# EAGLE design MainBoard 1.9.0 (EAGLE 9.6.2)
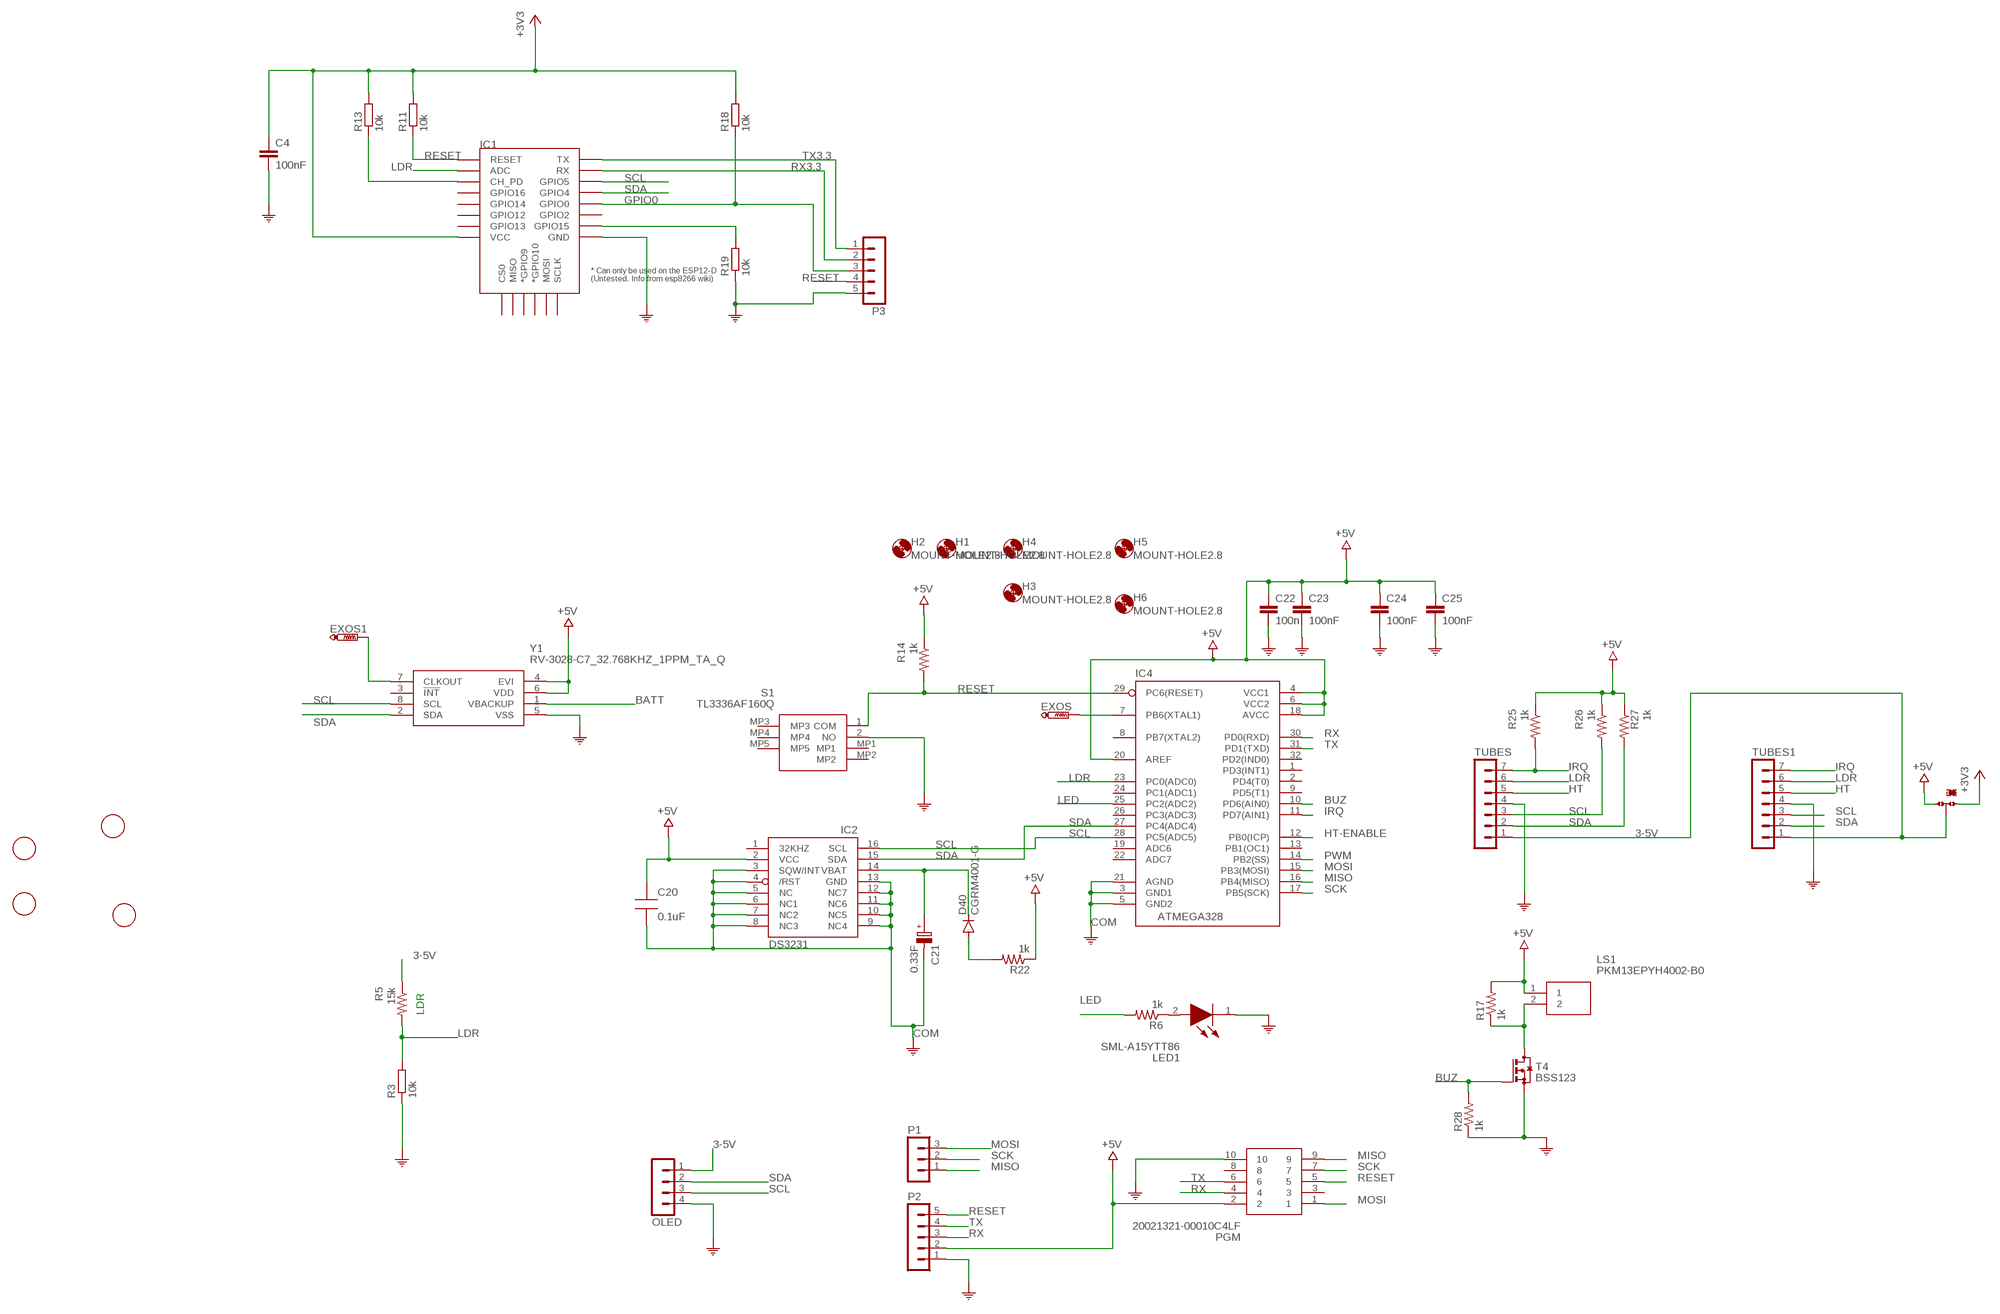
[diagram p0: schematic, sheet 1, part 1 of 2]
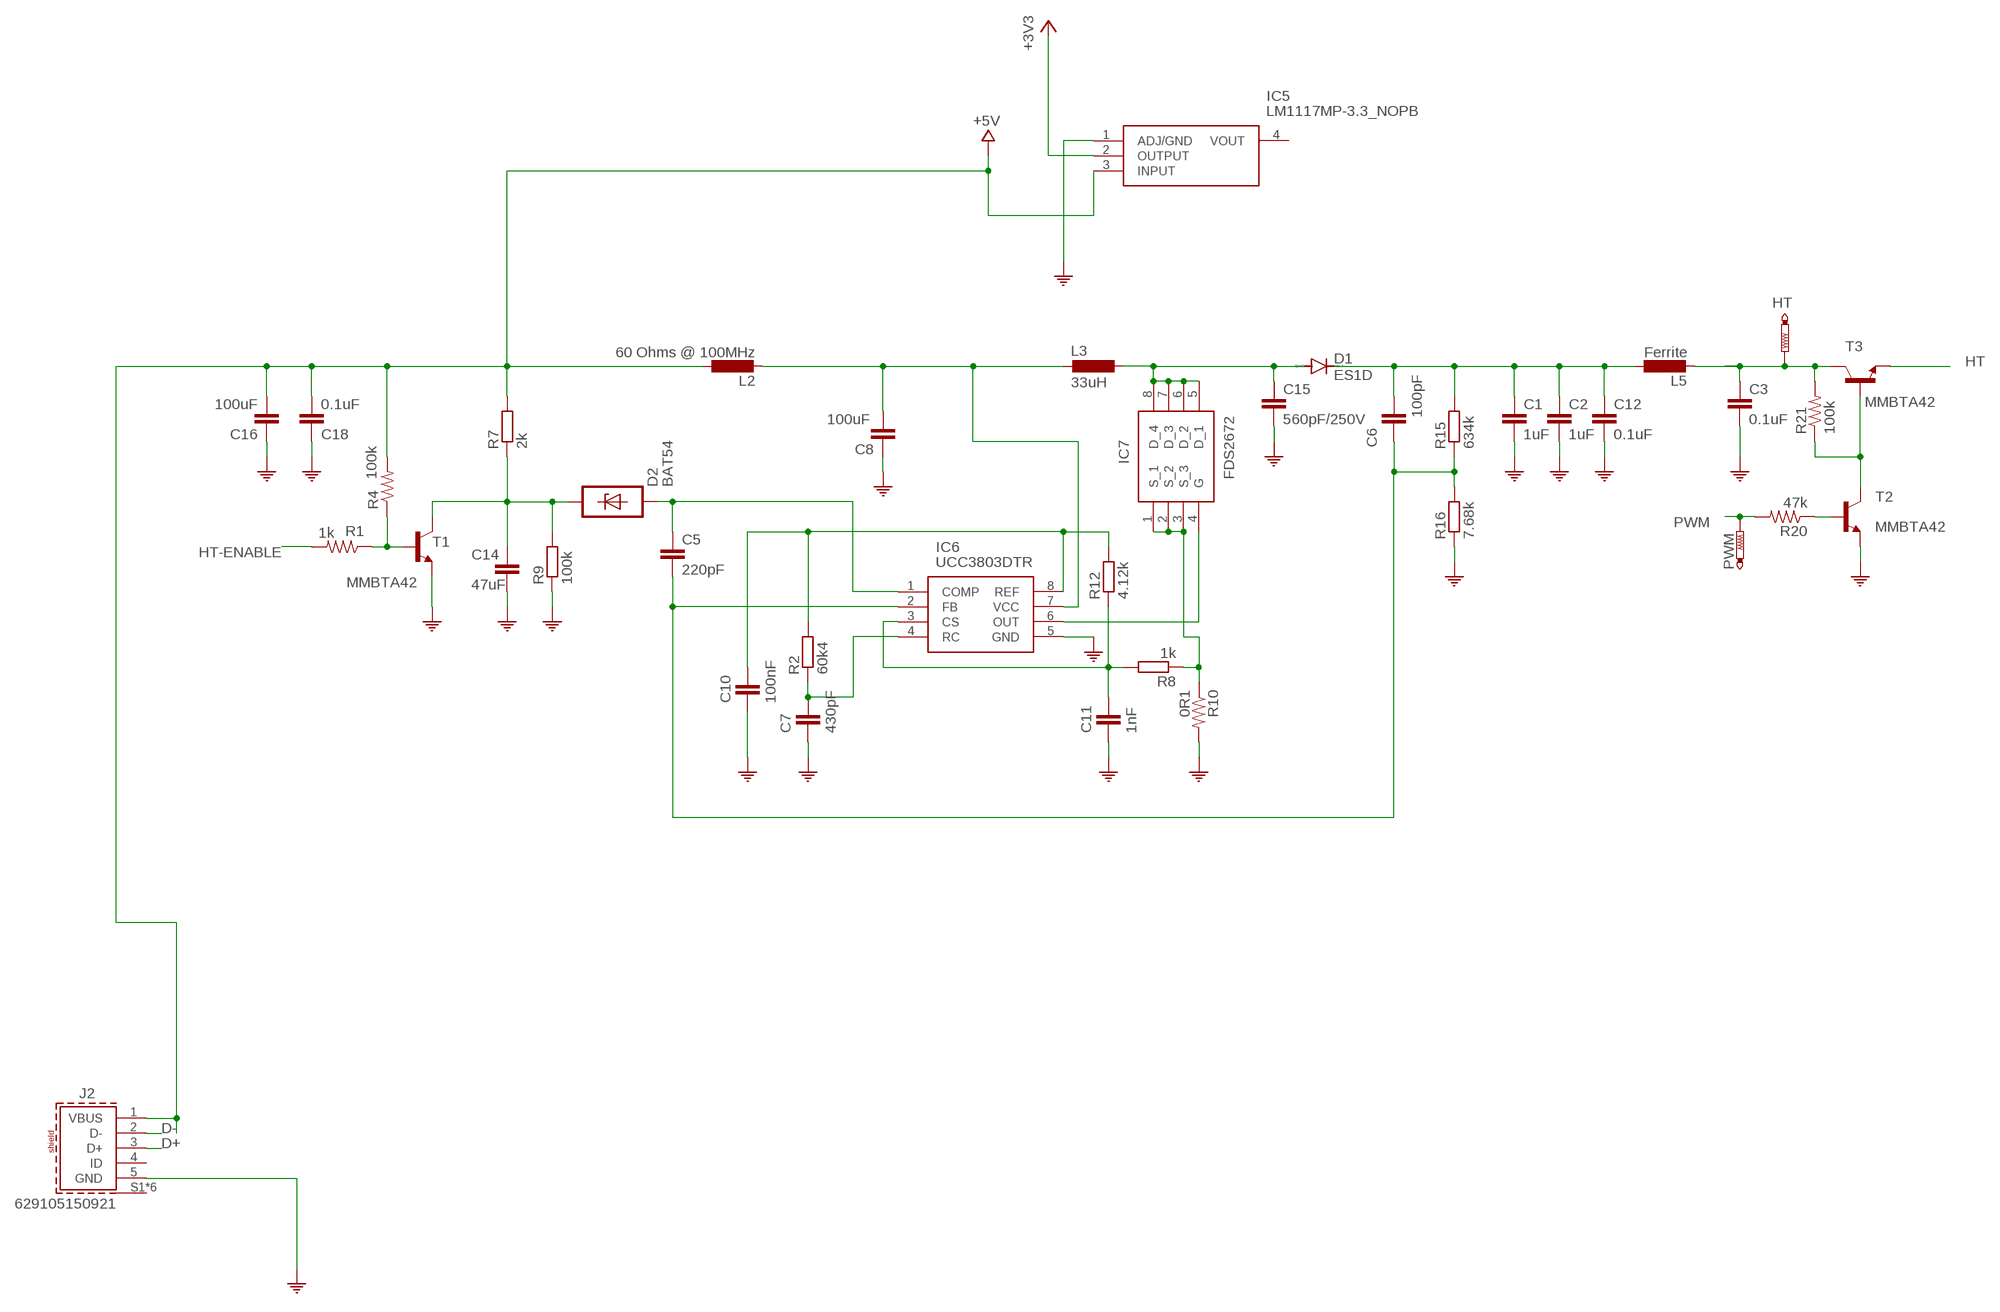
[diagram p1: schematic, sheet 1, part 2 of 2]

## Parts
C1  1uF  C-EUC1812K  [C1812K]
C2  1uF  C-EUC1812K  [C1812K]
C3  0.1uF  C-EUC1808  [C1808]
C4  100nF  C-EUC1812K  [C1812K]
C5  220pF  C-EUC0402  [C0402]
C6  100pF  C-EUC0805  [C0805]
C7  430pF  C-EUC0805  [C0805]
C8  100uF  C-EUC1210  [C1210]
C10  100nF  C-EUC0805  [C0805]
C11  1nF  C-EUC0805  [C0805]
C12  0.1uF  C-EUC1808  [C1808]
C14  47uF  C-EUC1210  [C1210]
C15  560pF/250V  C-EUC0603  [C0603]
C16  100uF  C-EUC1210  [C1210]
C18  0.1uF  C-EUC0402  [C0402]
C20  0.1uF  CAP0805-NP  [CAP0805-NP]
C21  0.33F  AHG-35/100-RADIAL  [ELNA21.5X8.0]
C22  100n  C-EUC0805  [C0805]
C23  100nF  C-EUC0805  [C0805]
C24  100nF  C-EUC0805  [C0805]
C25  100nF  C-EUC0805  [C0805]
D1  ES1D  ES2D  [SMB]
D2  BAT54  SP4020-01FTG  [SOD323]
D40  CGRM4001-G  [SOD-123_MINI-SMA]
EXOS  PTR1TP09R  [TP09R]
EXOS1  PTR1TP09R  [TP09R]
H1  MOUNT-HOLE2.8  [2,8]
H2  MOUNT-HOLE2.8  [2,8]
H3  MOUNT-HOLE2.8  [2,8]
H4  MOUNT-HOLE2.8  [2,8]
H5  MOUNT-HOLE2.8  [2,8]
H6  MOUNT-HOLE2.8  [2,8]
HT  PTR1TP09R  [TP09R]
IC1  ESP12ESMD  [ESP12E-SMD]
IC2  DS3231/SO  [SO16W]
IC4  ATMEGA328  ATMEGA168-20AU  [QFP032]
IC5  LM1117MP-3.3_NOPB  [SOT230P700X180-4N]
IC6  UCC3803DTR  [SOIC127P600X175-8N]
IC7  FDS2672  [SOIC127P600X175-8N]
J2  629105150921  [629105150921]
L2  60 Ohms @ 100MHz  L-EUL2012C  [L2012C]
L3  33uH  MSS7341  [MSS7341]
L5  Ferrite  L-EUL2012C  [L2012C]
LED1  SML-A15YTT86  [SMLA15YTT86]
LS1  PKM13EPYH4002-B0  [PKM13EPYH4002-B0]
OL2  0R-JUMPA  [A0R-JMP]
OLED  MA04-1  [MA04-1]
P1  MA03-1  [MA03-1]
P2  MA05-1  [MA05-1]
P3  MA05-1  [MA05-1]
PGM  20021321-00010C4LF  [2002132100010C4LF]
PWM  PTR1TP09R  [TP09R]
R1  1k  R-US_R0805  [R0805]
R2  60k4  R-EU_R0805  [R0805]
R3  10k  R-EU_M2012  [M2012]
R4  100k  R-US_R0805  [R0805]
R5  15k  R-US_0204/2V  [0204V]
R6  1k  R-US_M2012  [M2012]
R7  2k  R-EU_R0805  [R0805]
R8  1k  R-EU_R0805  [R0805]
R9  100k  R-EU_R0805  [R0805]
R10  0R1  R-US_R2010  [R2010]
R11  10k  R-EU_M0805  [M0805]
R12  4.12k  R-EU_R0805  [R0805]
R13  10k  R-EU_M0805  [M0805]
R14  1k  R-US_M2012  [M2012]
R15  634k  R-EU_R0805  [R0805]
R16  7.68k  R-EU_R0805  [R0805]
R17  1k  R-US_M2012  [M2012]
R18  10k  R-EU_M0805  [M0805]
R19  10k  R-EU_M0805  [M0805]
R20  47k  R-US_R0805  [R0805]
R21  100k  R-US_R0805  [R0805]
R22  1k  R-US_M2012  [M2012]
R25  1k  R-US_M2012  [M2012]
R26  1k  R-US_M2012  [M2012]
R27  1k  R-US_M2012  [M2012]
R28  1k  R-US_M2012  [M2012]
S1  TL3336AF160Q  [TL3336AF160Q]
T1  MMBTA42  BC846  [SOT23]
T2  MMBTA42  BC846  [SOT23]
T3  MMBTA42  BC846  [SOT23]
T4  BSS123  [SOT23]
TUBES  MA07-1  [MA07-1]
TUBES1  MA07-1  [MA07-1]
U$4  FIDUCIAL  [FIDUCIAL_1MM]
U$5  FIDUCIAL  [FIDUCIAL_1MM]
U$20  FIDUCIAL  [FIDUCIAL_1MM]
U$36  FIDUCIAL  [FIDUCIAL_1MM]
Y1  RV-3028-C7_32.768KHZ_1PPM_TA_Q  [RV3028C732768KHZ1PPMTAQC]

## Nets
3-5V [pwr]: OL2.2 OLED.1 R5.1 TUBES1.1 TUBES.1
+3V3: C4.1 IC1.VCC IC5.2(OUTPUT) OL2.1 R11.2 R13.2 R18.2
+5V [pwr]: C16.2 C18.1 C20.1 C22.1 C23.1 C24.1 C25.1 IC2.2(VCC) IC4.4(VCC1) IC4.6(VCC2) IC4.18(AVCC) IC4.20(AREF) IC5.3(INPUT) J2.1(VBUS) L2.1 LS1.1 OL2.3 P2.2 PGM.2 R4.2 R7.2 R14.1 R17.2 R22.1 R25.1 R26.1 R27.1 Y1.4(EVI) Y1.6(VDD)
BATT: C21.+ D40.C IC2.14(VBAT) Y1.1(VBACKUP)
BUZ: IC4.10(PD6(AIN0)) R28.2 T4.1(G)
COM: C1.2 C2.2 C3.2 C4.2 C7.2 C8.1 C10.2 C11.2 C12.2 C14.2 C15.2 C16.1 C18.2 C20.2 C21.- C22.2 C23.2 C24.2 C25.2 IC1.GND IC2.3(SQW/INT) IC2.4(/RST) IC2.5(NC) IC2.6(NC1) IC2.7(NC2) IC2.8(NC3) IC2.9(NC4) IC2.10(NC5) IC2.11(NC6) IC2.12(NC7) IC2.13(GND) IC4.3(GND1) IC4.5(GND2) IC4.21(AGND) IC5.1(ADJ/GND) IC6.5(GND) J2.5(GND) LED1.1(K) OLED.4 P2.1 P3.5 PGM.10 R3.1 R9.1 R10.2 R16.1 R19.1 R28.1 S1.2(NO) T1.2(E) T2.2(E) T4.2(S) TUBES1.4 TUBES.4 Y1.5(VSS)
CS: C11.1 IC6.3(CS) R8.2 R12.1
D+: J2.3(D+)
D-: J2.2(D-)
FB: C5.2 C6.2 IC6.2(FB) R15.1 R16.2
GPIO0: IC1.GPIO0 P3.3 R18.1
HT: T3.2(E) TUBES1.5 TUBES.5
HT-ENABLE: IC4.12(PB0(ICP)) R1.2
IRQ: IC4.11(PD7(AIN1)) R25.2 TUBES1.7 TUBES.7
LDR: IC1.ADC IC4.23(PC0(ADC0)) R3.2 R5.2 TUBES1.6 TUBES.6
LED: IC4.25(PC2(ADC2)) R6.2
MISO: IC4.16(PB4(MISO)) P1.1 PGM.9
MOSI: IC4.15(PB3(MOSI)) P1.3 PGM.1
N$1: LED1.2(A) R6.1
N$2: IC1.CH_PD R13.1
N$3: LS1.2 R17.1 T4.3(D)
N$5: EXOS.TP IC4.7(PB6(XTAL1))
N$6: C1.1 C2.1 C6.1 C12.1 D1.C L5.1 R15.2
N$7: R21.1 T2.3(C) T3.1(B)
N$8: R1.1 R4.1 T1.1(B)
N$9: C14.1 D2.C R7.1 R9.2 T1.3(C)
N$10: C5.1 D2.A IC6.1(COMP)
N$11: IC1.GPIO15 R19.2
N$12: IC7.1(S_1) IC7.2(S_2) IC7.3(S_3) R8.1 R10.1
N$13: EXOS1.TP Y1.7(CLKOUT)
N$14: C8.2 IC6.7(VCC) L2.2 L3.1
N$18: C15.1 D1.A IC7.5(D_1) IC7.6(D_2) IC7.7(D_3) IC7.8(D_4) L3.2
N$19: R20.1 T2.1(B)
N$23: D40.A R22.2
OUT: IC6.6(OUT) IC7.4(G)
PWM: IC4.14(PB2(SS)) PWM.TP R20.2
RAW_HT: C3.1 HT.TP L5.2 R21.2 T3.3(C)
RC: C7.1 IC6.4(RC) R2.1
REF: C10.1 IC6.8(REF) R2.2 R12.2
RESET: IC1.RESET IC4.29(PC6(RESET)) P2.5 P3.4 PGM.5 R11.1 R14.2 S1.1(COM)
RX: IC4.30(PD0(RXD)) P2.3 PGM.4
RX3.3: IC1.RXD0(RX) P3.2
SCK: IC4.17(PB5(SCK)) P1.2 PGM.7
SCL: IC1.GPIO5 IC2.16(SCL) IC4.28(PC5(ADC5)) OLED.3 R26.2 TUBES1.3 TUBES.3 Y1.8(SCL)
SDA: IC1.GPIO4 IC2.15(SDA) IC4.27(PC4(ADC4)) OLED.2 R27.2 TUBES1.2 TUBES.2 Y1.2(SDA)
TX: IC4.31(PD1(TXD)) P2.4 PGM.6
TX3.3: IC1.TXD0(TX) P3.1
Unconnected: IC1.CS0 IC1.GPIO2 IC1.GPIO9(*GPIO9) IC1.GPIO10(*GPIO10) IC1.GPIO12 IC1.GPIO13 IC1.GPIO14 IC1.GPIO16 IC1.MISO IC1.MOSI IC1.SCLK IC2.1(32KHZ) IC4.1(PD3(INT1)) IC4.2(PD4(T0)) IC4.8(PB7(XTAL2)) IC4.9(PD5(T1)) IC4.13(PB1(OC1)) IC4.19(ADC6) IC4.22(ADC7) IC4.24(PC1(ADC1)) IC4.26(PC3(ADC3)) IC4.32(PD2(IND0)) IC5.4(VOUT) J2.4(ID) J2.S1(SHIELD) J2.S2(SHIELD) J2.S3(SHIELD) J2.S4(SHIELD) J2.S5(SHIELD) J2.S6(SHIELD) PGM.3 PGM.8 S1.MP1 S1.MP2 S1.MP3 S1.MP4 S1.MP5 Y1.3(!INT)

## Notes on the sheet
- LDR

## Library data of the parts
C1 C2 = rcl:C-EU: CAPACITOR, European symbol; MOUSER: 810-CGA8P3X7T2E105MA; PU: 1.07; SPICEPREFIX: C; TDK: C4532X7T2E105M250KE
C3 C12 = rcl:C-EU: CAPACITOR, European symbol; MOUSER: 581-1808PC104KAT1A; PU: 0.88; SPICEPREFIX: C
C4 = resistor:C-EU: CAPACITOR, European symbol
C5 = rcl:C-EU: CAPACITOR, European symbol; MOUSER: 963-LMK042B7221KC-W; SPICEPREFIX: C
C6 = rcl:C-EU: CAPACITOR, European symbol; MOUSER: 81-GCM21A5C2E101JX1D; PU: 0.319; SPICEPREFIX: C
C7 = rcl:C-EU: CAPACITOR, European symbol; MOUSER: 581-08055A431JAT4A; PU: 0.23; SPICEPREFIX: C
C8 C16 = rcl:C-EU: CAPACITOR, European symbol; MOUSER: 963-EMK325ABJ107MM-P; SPICEPREFIX: C; TAIYO_YUDEN: EMK325ABJ107MM-P
C10 = rcl:C-EU: CAPACITOR, European symbol; MOUSER: 963-EMF212B7104KGHT; PU: 0.23; SPICEPREFIX: C
C11 = rcl:C-EU: CAPACITOR, European symbol; MOUSER: 710-885382207004; PU: 0.122; SPICEPREFIX: C
C14 = rcl:C-EU: CAPACITOR, European symbol; MOUSER: EMK316BBJ476ML-T; SPICEPREFIX: C
C15 = rcl:C-EU: CAPACITOR, European symbol; MOUSER: 80-C0603C561JAG; PU: 0.038; SPICEPREFIX: C
C18 = rcl:C-EU: CAPACITOR, European symbol; MOUSER: 963-LMF105B7104KVHF; PU: 0.676; SPICEPREFIX: C
C20 = MySMD:CAP0805-NP
C21 = Elkos:AHG-35/100-RADIAL: AUDYN® - AHG Gepolt, radial High Grade AHG Gepolter Elekrolytkondensator für Audio-Netzteile, oder Verstärker im Home- und Car-Bereich. Technische Daten Anschlußdrähte: Kupfer, verzinnt AL: ? mm d2ø : ? mm Kapazitätsbereich: von 10 µF bis 2200 µF Nennspannungen: 25 V, 35 V, 50 V, 100 V C-Toleranz: 20 % ( bei 20° C ) Verlustfaktor: tan δ < 0,100 @ 1 kHz Temperaturbereich: - 40° C bis 85° C Verzerrung: sehr gering bei 10 kHz, 010 A - 120 dB oder niedriger gepolt AHG AUDYN® - AHG gepolt Bezeichnung C U DxH Rm Bestell.-Nr. U / Volt D x L/mm mm AHG/10.0/100V 10µF 100V 10x15 5,0 1341690 AHG/22.0/50V 22µF 50V 10x13 5,0 1341691 AHG/47.0/50V 47µF 50V 10x16 5,0 1341692 AHG/100.0/50V 100µF 50V 13x21 5,0 1341693 AHG/220.0/50V 220µF 50V 16x25 7,5 1341694 AHG/470.0/50V 470µF 50V 16x37 7,5 1341695 AHG/1000/35V 1000µF 35V 18x37 7,5 1341696 AHG/2200/35V 2200µF 35V 22x38 10,0 1341697 Alle Abmessungen in mm; MOUSER: 555-DBN-5R5D334T; PU: 2.46
C22-C25 = rcl:C-EU: CAPACITOR, European symbol; SPICEPREFIX: C
D1 = diode:ES2D: DIODE super fast rectifier, 2 A; MOUSER: 512-ES1D
D2 = sp4020_11:SP4020-01FTG: SP4020 Series 2.5pF, 30A Discrete TVS Diode Source: http://www.littelfuse.com/~/media/electronics/datasheets/tvs_diode_arrays/littelfuse_tvs_diode_array_sp4020_datasheet.pdf.pdf; MF: Littelfuse; MOUSER: 621-BAT54WS-F; MPN: SP4020-01FTG; OC_FARNELL: unknown; OC_NEWARK: 05X0400
D40 = diode:CGRM400*-G: Molded plasitc,JEDEC SOD-123/Mini SMA Source: Comchip CGRM4001-G.pdf; MOUSER: 771-PMEG2010EA135; PU: 0.22
EXOS EXOS1 HT PWM = testpad:PTR1: TEST PIN
H1-H6 = holes:MOUNT-HOLE: MOUNTING HOLE with drill center marker
IC1 = esp8266modules:ESP12E: ESP12E Module
IC2 = DS3231:DS3231; AVAILABILITY: Unavailable; MF: Maxim Integrated; MOUSER: 700-DS3231SN#; MP: DS3231; PACKAGE: SOIC-16 Maxim Integrated; PRICE: None; PU: 9.50
IC4 = MySMD:ATMEGA168-20AU; PU: 1.40
IC5 = SamacSys_Parts:LM1117MP-3.3_NOPB: Space saving 800-mA low-dropout linear regulator with internal current limit Source: Datasheet <http://www.ti.com/general/docs/suppproductinfo.tsp?distId=10&gotoUrl=http://www.ti.com/lit/gpn/lm1117>; DESCRIPTION: Space saving 800-mA low-dropout linear regulator with internal current limit; HEIGHT: 1.8mm; MANUFACTURER_NAME: Texas Instruments; MANUFACTURER_PART_NUMBER: LM1117MP-3.3/NOPB; MOUSER_PART_NUMBER: 926-LM1117MP-3.3NOPB; MOUSER_PRICE-STOCK: https://www.mouser.co.uk/ProductDetail/Texas-Instruments/LM1117MP-33-NOPB?qs=X1J7HmVL2ZFn4x9DZ4T2hA%3D%3D
IC6 = UCC3803DTR:UCC3803DTR: Switching Controllers Low-Power BiCMOS Current-Mode PWM Source: Datasheet <http://www.ti.com/lit/ds/symlink/ucc3803.pdf>; DESCRIPTION: Switching Controllers Low-Power BiCMOS Current-Mode PWM; HEIGHT: 1.75mm; MANUFACTURER_NAME: Texas Instruments; MANUFACTURER_PART_NUMBER: UCC3803DTR; MOUSER: 595-UCC3803D; MOUSER_PART_NUMBER: 595-UCC3803DTR; MOUSER_PRICE-STOCK: https://www.mouser.com/Search/Refine.aspx?Keyword=595-UCC3803DTR; PU: 3.05
IC7 = FDS2672:FDS2672: FDS2672, N-channel MOSFET Transistor 3.9 A 200 V, 8-Pin SOIC Source: Datasheet <http://docs-emea.rs-online.com/webdocs/0d23/0900766b80d23481.pdf>; DESCRIPTION: FDS2672, N-channel MOSFET Transistor 3.9 A 200 V, 8-Pin SOIC; HEIGHT: 1.75mm; MANUFACTURER_NAME: Fairchild Semiconductor; MANUFACTURER_PART_NUMBER: FDS2672; MOUSER: 512-FDS2672; MOUSER_PART_NUMBER: 512-FDS2672; MOUSER_PRICE-STOCK: https://www.mouser.com/Search/Refine.aspx?Keyword=512-FDS2672; PU: 1.54; RS_PART_NUMBER: 6710481P; RS_PRICE-STOCK: http://uk.rs-online.com/web/p/products/6710481P
J2 = Wurth_Connectors_WR-USB:629105150921: WR-COM Micro USB 2.0 Type AB Horizontal Kind Properties Durability:10 000 Mating cycles Connector Type:Micro USB Gender:Receptacle Type:Horizontal General Information Operating Temperature:-40up to +85 °C Electrical Properties Working Voltage:30V (AC) Withstanding Voltage:100V (AC) Contact Resistance:30 mΩ Material Properties Insulator Material:LCP Insulator Flammability Rating:UL94 V-0 Color:Black Contact Material:Copper Alloy Contact Plating: Gold Contact Type:Stamped Shielding Material:Stainless Steel Shielding Plating:Matte Tin <https://www.we-online.com/catalog/media/o33046v209%20Family_WR-COM_Micro_USB_629105150921.jpg> Details see: https://www.we-online.com/catalog/en/COM_MICRO_2_0_TYPE_AB_HORIZONTAL/ Updated by Ella Wu 2021-03-09 2021 (C) Würth Elektronik; APPLICATION: Micro USB 2.0; DATASHEET-URL: https://www.we-online.com/catalog/datasheet/629105150921.pdf; GERDER: Receptacle; INTERFACE-TYPE: Type AB; IR1: 1.8A; MOUNT: SMT; MOUSER: 710-629105150921; PACKAGING: Tape and Reel; PART-NUMBER: 629105150921; PINS: 5; PU: 1.90; TYPE: Horizontal; WORKING-VOLTAGE: 30V(AC)
L2 L5 = rcl:L-EU: INDUCTOR, European symbol; MOUSER: 963-BKP2125HS600-T; SPICEPREFIX: L
L3 = STEAM-inductor-coilcraft:MSS7341: Shielded Power Inductors Package 6.6 × 6.6 mm x 4.1 mm high Source: http://www.farnell.com/datasheets/1681958.pdf; MOUSER: 710-784770330; PU: 2.55
LED1 = SamacSys_Parts:SML-A15YTT86: Yellow 590nm LED Indication - Discrete 2.1V 2-SMD, No Lead Source: Datasheet <https://fscdn.rohm.com/en/products/databook/datasheet/opto/led/chip_mono/sml-a15x-e.pdf>; DESCRIPTION: Yellow 590nm LED Indication - Discrete 2.1V 2-SMD, No Lead; HEIGHT: 0.65mm; MANUFACTURER_NAME: ROHM Semiconductor; MANUFACTURER_PART_NUMBER: SML-A15YTT86; MOUSER: 755-SML-A15YTT86; PU: 0.25
LS1 = SamacSys_Parts:PKM13EPYH4002-B0: Transducer piezo PCB 30Vpp 70dB 12.6mm Murata Buzzer Source: Datasheet <http://www.murata.com/~/media/webrenewal/support/library/catalog/products/sound/p37e.ashx>; DESCRIPTION: Transducer piezo PCB 30Vpp 70dB 12.6mm Murata Buzzer; HEIGHT: mm; MANUFACTURER_NAME: Murata Electronics; MANUFACTURER_PART_NUMBER: PKM13EPYH4002-B0; MOUSER_PART_NUMBER: 81-PKM13EPYH4002-B0; MOUSER_PRICE-STOCK: https://www.mouser.co.uk/ProductDetail/Murata-Electronics/PKM13EPYH4002-B0?qs=flZjIlU0hx09jX8FupUNIw%3D%3D
OL2 = jump-0r-smd:0R-JUMP: SMD 0R 0805 Jumper
OLED = con-lstb:MA04-1: PIN HEADER; OC_FARNELL: unknown; OC_NEWARK: unknown
P1 = con-lstb:MA03-1: PIN HEADER; OC_FARNELL: unknown; OC_NEWARK: unknown
P2 P3 = con-lstb:MA05-1: PIN HEADER; OC_FARNELL: unknown; OC_NEWARK: unknown
PGM = SamacSys_Parts:20021321-00010C4LF: Headers & Wire Housings 1.27x1.27mm BTB, Hdr Recept, SMT, 10 Pos Source: Datasheet <https://componentsearchengine.com/Datasheets/1/20021321-00010C4LF.pdf>; DESCRIPTION: Headers & Wire Housings 1.27x1.27mm BTB, Hdr Recept, SMT, 10 Pos; HEIGHT: 4.75mm; MANUFACTURER_NAME: Amphenol; MANUFACTURER_PART_NUMBER: 20021321-00010C4LF; MOUSER_PART_NUMBER: 649-200211210010D8LF; MOUSER_PRICE-STOCK: https://www.mouser.com/Search/Refine.aspx?Keyword=649-202132100010C4LF
R1 R6 R14 R17 R22 R25-R28 = adafruit:R-US_: RESISTOR, American symbol; MOUSER: 660-RK73H2ATTDD1001F
R2 = rcl:R-EU_: RESISTOR, European symbol; MOUSER: 603-RT0805FRE0760K4L; PU: 0.11; SPICEPREFIX: R
R3 = rcl:R-EU_: RESISTOR, European symbol; MOUSER: 660-RK73H2ATTDD1002F; SPICEPREFIX: R
R4 R5 R20 R21 = adafruit:R-US_: RESISTOR, American symbol
R7 = rcl:R-EU_: RESISTOR, European symbol; MOUSER: 754-RR1220P-202D; SPICEPREFIX: R; SUSUMU: RR1220P-202-D
R8 = rcl:R-EU_: RESISTOR, European symbol; MOUSER: 660-RK73H2ATTDD1001F; SPICEPREFIX: R
R9 = rcl:R-EU_: RESISTOR, European symbol; SPICEPREFIX: R
R10 = adafruit:R-US_: RESISTOR, American symbol; MOUSER: 603-PE2010FKE070R1L; PU: 0.7
R11 R13 R18 R19 = resistor:R-EU_: RESISTOR, European symbol; MOUSER: 660-RK73H2ATTDD1002F
R12 = rcl:R-EU_: RESISTOR, European symbol; KOASPEER: RN732ATTD4121F100; MOUSER: 660-RN732ATD4121F100; SPICEPREFIX: R
R15 = rcl:R-EU_: RESISTOR, European symbol; MOUSER: 71-CRCW0603-634K-E3; SPICEPREFIX: R; VISHAY: CRCW0603634KFKEA
R16 = rcl:R-EU_: RESISTOR, European symbol; MOUSER: 71-CRCW0805-7.68K-E3; PU: 0.09; SPICEPREFIX: R; VISHAY: CRCW08057K68FKEA
S1 = SamacSys_Parts:TL3336AF160Q: Tactile Switches Tactile Switch SPST OFF-(ON) 50mA, 12VDC, Right Angle SMT Source: Datasheet <http://spec_sheets.e-switch.com/specs/P158001.pdf>; DESCRIPTION: Tactile Switches Tactile Switch SPST OFF-(ON) 50mA, 12VDC, Right Angle SMT; HEIGHT: 7.35mm; MANUFACTURER_NAME: E-Switch; MANUFACTURER_PART_NUMBER: TL3336AF160Q; MOUSER_PART_NUMBER: 612-TL3336AF160Q; MOUSER_PRICE-STOCK: https://www.mouser.co.uk/ProductDetail/E-Switch/TL3336AF160Q?qs=iLbezkQI%252Bshf0NMs3%252BGhxA%3D%3D
T1-T3 = transistor:BC846: NPN TRANSISTOR
T4 = transistor-small-signal:BSS123: N-CHANNEL MOS FET; MOUSER: 726-BSS123NH6433; PU: 0.37
TUBES TUBES1 = con-lstb:MA07-1: PIN HEADER; OC_FARNELL: unknown; OC_NEWARK: unknown
U$4 U$5 U$20 U$36 = adafruit:FIDUCIAL: For use by pick and place machines to calibrate the vision/machine, 1mm By microbuilder.eu
Y1 = SamacSys_Parts:RV-3028-C7_32.768KHZ_1PPM_TA_Q: Real Time Clock 32.768kHz I2C Time Acc. 1ppm Source: Datasheet <https://www.microcrystal.com/fileadmin/Media/Products/RTC/Datasheet/RV-3028-C7.pdf>; DESCRIPTION: Real Time Clock 32.768kHz I2C Time Acc. 1ppm; HEIGHT: 0.8mm; MANUFACTURER_NAME: Micro Crystal AG; MANUFACTURER_PART_NUMBER: RV-3028-C7 32.768kHz 1ppm TA QC; MOUSER_PART_NUMBER: 428-203591-MG01; MOUSER_PRICE-STOCK: https://www.mouser.co.uk/ProductDetail/Micro-Crystal/RV-3028-C7-32768kHz-1ppm-TA-QC?qs=u16ybLDytRaU7ZFJl2AxfQ%3D%3D

## Module TUBEIN16
Ports: 

### Library data of the parts

## Net classes
0 default: width 0.254 mm, clearance 0.254 mm
1 pwr: width 0.254 mm, clearance 0.356 mm

## Board
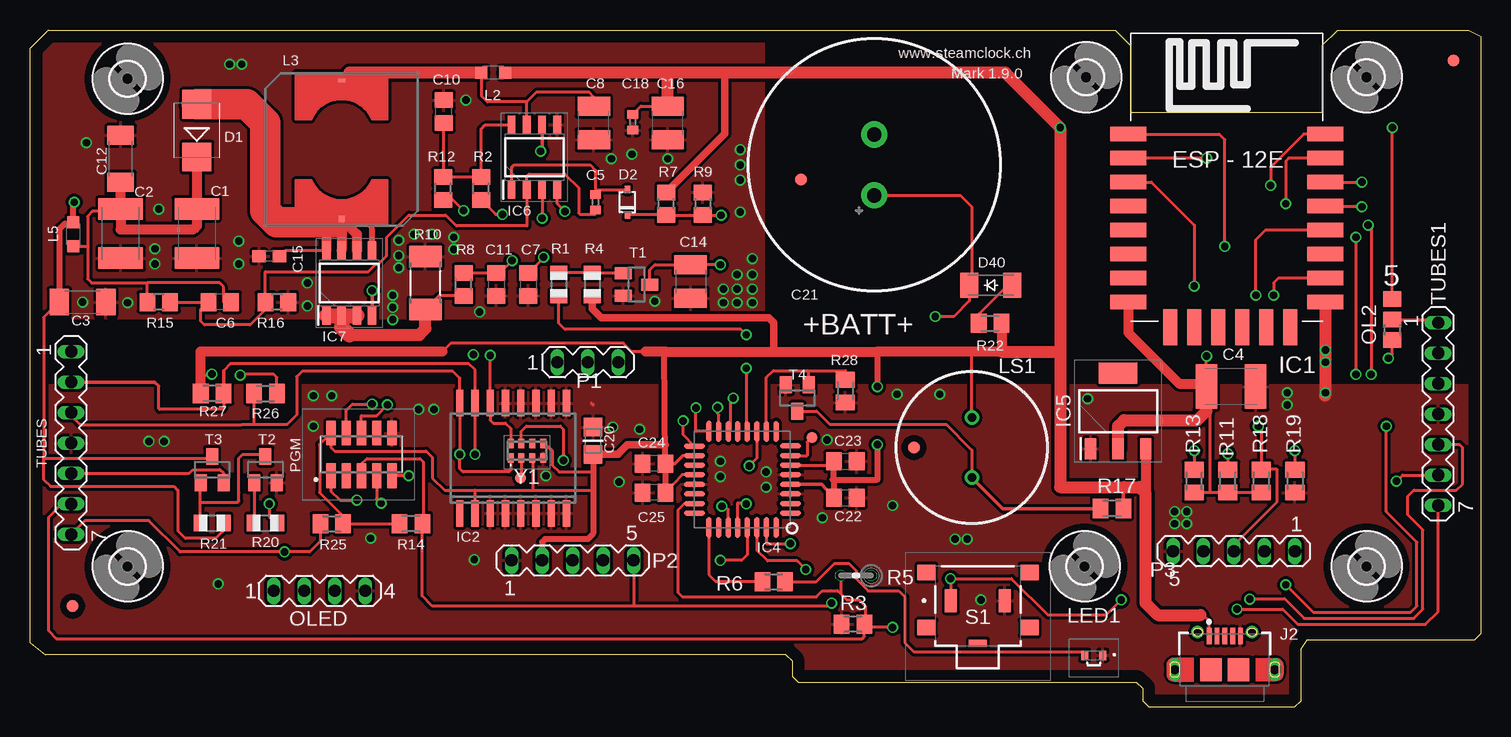
[diagram p2: board, top side]
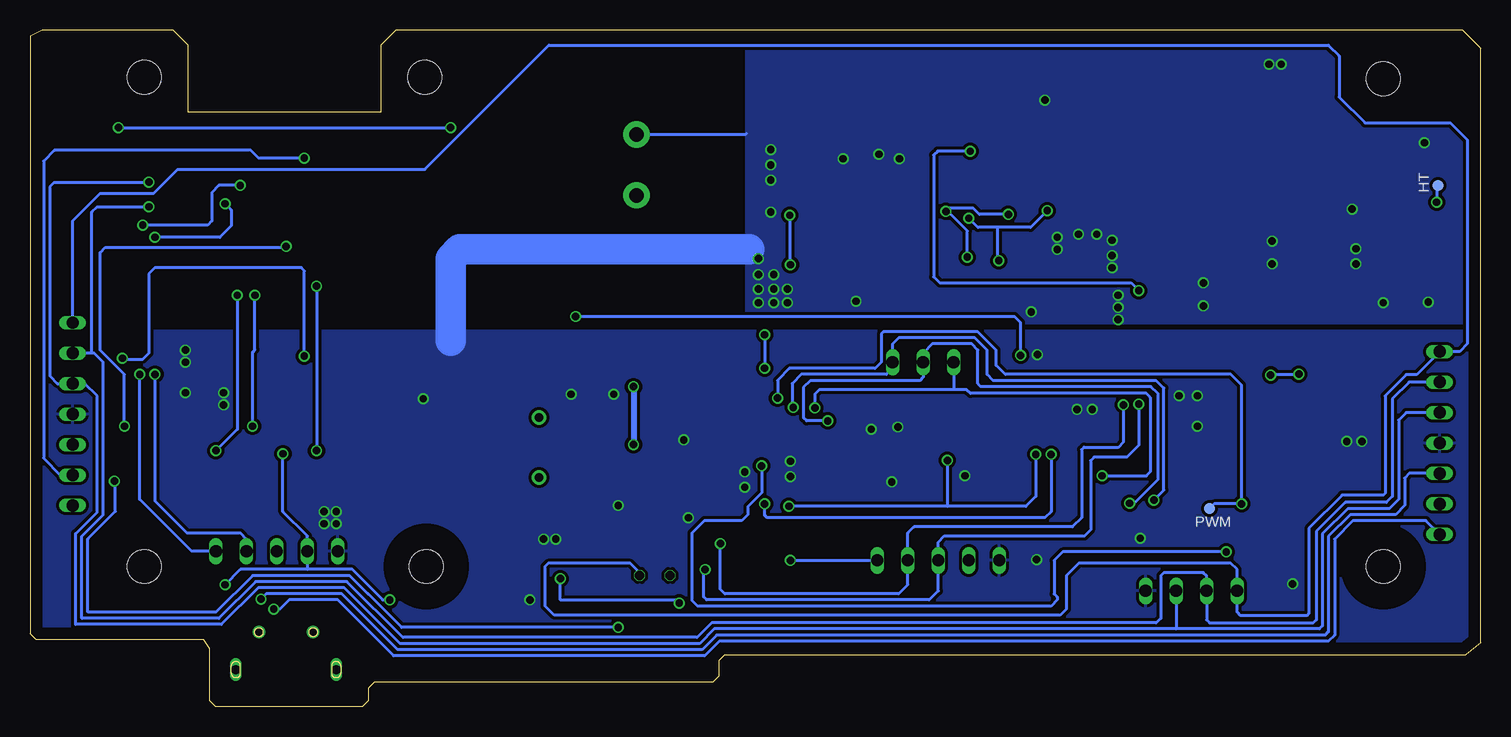
[diagram p3: board, bottom side, seen from below]

Size 120.9 x 56.39 mm. Coordinates in mm from the lower left corner, seen from the top.
Outline: 1.52,56.39 90.42,56.39 91.69,55.12 91.69,49.53 107.7,49.53 107.7,55.12 108.97,56.39 119.89,56.39 120.9,55.88 120.9,6.1 120.4,5.59 106.43,5.59 105.92,4.83 105.92,0.51 105.41,0 93.22,0 92.71,0.51 92.71,1.52 92.2,2.03 64.01,2.03 63.5,2.54 63.5,3.81 62.99,4.32 1.27,4.32 0,5.33 0,54.86 1.52,56.39
Copper layers (1*16): Top 0.035mm / dielectric 1.5mm / Bottom 0.035mm
Design rules "default": minimum track width 10mil, minimum drill 24mil, track to track 4mil, track to pad 4mil, pad to pad 4mil, via to via 8mil, smd to smd 8mil, copper to edge 40mil, drill to drill 8mil, minimum pad ring 1mil, minimum via ring 3mil, stop-mask expansion 4mil, vias tented up to drill 0mil, thermal gap 10mil

### Footprints (pad centres in the part's own frame; a part is rotated, then mirrored left to right if it is on the bottom)
C1812K = smd 1.8 x 3.7: 1 -2.05,0; 2 2.05,0
C1808 = smd 1.6 x 2.2: 1 -1.95,0; 2 1.95,0
C0402 = smd 0.7 x 0.9: 1 -0.65,0; 2 0.65,0
C0805 = smd 1.3 x 1.5: 1 -0.95,0; 2 0.95,0
C1210 = smd 1.6 x 2.7: 1 -1.4,0; 2 1.4,0
C0603 = smd 1.1 x 1: 1 -0.85,0; 2 0.85,0
CAP0805-NP = smd 1.524 x 1.524: 1 0,0; 2 2.286,0
ELNA21.5X8.0 = drill 1.2 pad 2.184: + -2.54,0; - 2.54,0
SMB = smd 2.4 x 2.4: A 2.2,0; C -2.2,0
SOD323 = smd 0.6 x 0.45: A 1.06,0; C -1.06,0
SOD-123_MINI-SMA = smd 1.5 x 2.1: A 1.8,0; C -1.8,0
TP09R = smd 0.9 x 0.9: TP 0,0
2,8 = hole 2.8: 0,0
ESP12E-SMD = smd 3 x 1.2: ADC -8.3,3.8; CH_PD -8.3,1.8; GND 8.1,-8.2; GPIO0 8.1,-2.2; GPIO2 8.1,-4.2; GPIO4 8.1,-0.2; GPIO5 8.1,1.8; GPIO12 -8.3,-4.2; GPIO13 -8.3,-6.2; GPIO14 -8.3,-2.2; GPIO15 8.1,-6.2; GPIO16 -8.3,-0.2; RESET -8.3,5.8; RXD0 8.1,3.8; TXD0 8.1,5.8; VCC -8.3,-8.2 | smd 1.2 x 3: CS0 -4.8,-10.3; GPIO9 -0.8,-10.3; GPIO10 1.2,-10.3; MISO -2.8,-10.3; MOSI 3.2,-10.3; SCLK 5.2,-10.3
SO16W = smd 0.6 x 2.2: 1 -4.445,-4.6; 2 -3.175,-4.6; 3 -1.905,-4.6; 4 -0.635,-4.6; 5 0.635,-4.6; 6 1.905,-4.6; 7 3.175,-4.6; 8 4.445,-4.6; 9 4.445,4.6; 10 3.175,4.6; 11 1.905,4.6; 12 0.635,4.6; 13 -0.635,4.6; 14 -1.905,4.6; 15 -3.175,4.6; 16 -4.445,4.6
QFP032 = smd 0.432 x 1.778: 1 0,0; 2 0.8,0; 3 1.599,0; 4 2.399,0; 5 3.199,0; 6 3.998,0; 7 4.798,0; 8 5.598,0; 17 5.588,8.001; 18 4.798,7.997; 19 3.998,7.997; 20 3.199,7.997; 21 2.399,7.997; 22 1.599,7.997; 23 0.799,7.997; 24 0,7.997 | smd 1.778 x 0.432: 9 6.807,1.194; 10 6.807,2.007; 11 6.807,2.794; 12 6.807,3.607; 13 6.807,4.394; 14 6.807,5.182; 15 6.807,5.994; 16 6.816,6.803; 25 -1.194,6.807; 26 -1.194,5.994; 27 -1.194,5.182; 28 -1.194,4.394; 29 -1.194,3.607; 30 -1.194,2.794; 31 -1.194,2.007; 32 -1.194,1.194
SOT230P700X180-4N = smd 1.75 x 0.95: 1 -3.15,2.3; 2 -3.15,0; 3 -3.15,-2.3 | smd 1.75 x 3.2: 4 3.15,0
SOIC127P600X175-8N = smd 1.525 x 0.65: 1 -2.712,1.905; 2 -2.712,0.635; 3 -2.712,-0.635; 4 -2.712,-1.905; 5 2.712,-1.905; 6 2.712,-0.635; 7 2.712,0.635; 8 2.712,1.905
SOIC127P600X175-8N' = smd 1.525 x 0.7: 1 -2.712,1.905; 2 -2.712,0.635; 3 -2.712,-0.635; 4 -2.712,-1.905; 5 2.712,-1.905; 6 2.712,-0.635; 7 2.712,0.635; 8 2.712,1.905
629105150921 = smd 0.4 x 1.35: 1 -1.3,2.335; 2 -0.65,2.335; 3 0,2.335; 4 0.65,2.335; 5 1.3,2.335 | drill 0.65 pad 1.05: S1 -2.26,2.65; S2 2.26,2.65 | drill 0.75 pad 0.95 long: S3 -4.175,-0.47; S6 4.175,-0.47 | smd 1.8 x 1.9: S4 -1.15,-0.47; S5 1.15,-0.47
L2012C = smd 1 x 1: 1 -1,0; 2 1,0
MSS7341 = smd 0.61 x 0.305: 1 0,5.765 | smd 0.5 x 0.5: 2 0,-5.765
SMLA15YTT86 = smd 0.6 x 0.8: 1 -0.75,-0.205; 2 0.75,-0.205
PKM13EPYH4002-B0 = drill 0.7 pad 1.2: 1 -2.5,0; 2 2.5,0
A0R-JMP = smd 1.5 x 1.3: 1 0,1.7; 2 0,0; 3 0,-1.7
MA04-1 = drill 1.016 long: 1 -3.81,0; 2 -1.27,0; 3 1.27,0; 4 3.81,0
MA03-1 = drill 1.016 long: 1 -2.54,0; 2 0,0; 3 2.54,0
MA05-1 = drill 1.016 long: 1 -5.08,0; 2 -2.54,0; 3 0,0; 4 2.54,0; 5 5.08,0
2002132100010C4LF = smd 0.76 x 2.05: 1 2.54,1.775; 2 2.54,-1.775; 3 1.27,1.775; 4 1.27,-1.775; 5 0,1.775; 6 0,-1.775; 7 -1.27,1.775; 8 -1.27,-1.775; 9 -2.54,1.775; 10 -2.54,-1.775
R0805 = smd 1.1 x 1.4: 1 -1,0; 2 1,0
R0805' = smd 1.3 x 1.5: 1 -0.95,0; 2 0.95,0
M2012 = smd 1.3 x 1.6: 1 -0.95,0; 2 0.95,0
0204V = drill 0.813 octagon: 1 -1.27,0; 2 1.27,0
R2010 = smd 1.8 x 2.7: 1 -2.2,0; 2 2.2,0
M0805 = smd 1.3 x 1.6: 1 -0.95,0; 2 0.95,0
TL3336AF160Q = smd 1 x 1.9: 1 2.25,-0.45; 2 -2.25,-0.45 | smd 1.5 x 1.3: MP1 4.3,1.8; MP2 4.3,-2.8; MP3 -4.3,-2.8; MP4 -4.3,1.8 | smd 1.5 x 0.6: MP5 0,3.1
SOT23 = smd 1 x 1.4: 1 -0.95,-1.1; 2 0.95,-1.1; 3 0,1.1
MA07-1 = drill 1.016 long: 1 -7.62,0; 2 -5.08,0; 3 -2.54,0; 4 0,0; 5 2.54,0; 6 5.08,0; 7 7.62,0
FIDUCIAL_1MM = smd 1 x 1: 1 0,0
RV3028C732768KHZ1PPMTAQC = smd 0.5 x 0.8: 1 -1.35,0.6; 2 -0.45,0.6; 3 0.45,0.6; 4 1.35,0.6; 5 1.35,-0.6; 6 0.45,-0.6; 7 -0.45,-0.6; 8 -1.35,-0.6

### Placement (x,y rotation side)
C1  13.91,39.43 270 top
C2  7.56,39.43 270 top
C3  4.38,33.72 0 top
C4  100.08,26.67 0 top
C5  47.12,42.04 270 top
C6  15.81,33.72 180 top
C7  41.53,35.18 270 top
C8  46.99,48.64 90 top
C10  34.48,49.59 90 top
C11  38.86,35.18 270 top
C12  7.56,45.66 90 top
C14  55.05,35.43 270 top
C15  19.94,37.53 180 top
C16  53.15,48.64 90 top
C18  50.23,48.7 270 top
C20  46.93,21.02 90 top
C21  70.36,45.15 90 top
C22  67.95,17.4 0 top
C23  67.95,20.45 0 top
C24  52.01,20.26 180 top
C25  52.01,17.84 180 top
D1  13.91,48.01 90 top
D2  49.78,42.04 90 top
D40  80.07,35.12 0 top
EXOS  65.15,22.42 0 top
EXOS1  40.89,19.05 0 top
H1  111.38,52.45 0 top
H2  111.38,11.68 0 top
H3  8.13,52.32 0 top
H4  8.13,11.68 0 top
H5  87.88,11.68 0 top
H6  88.01,52.45 0 top
HT  3.56,43.43 0 bottom
IC1  99.82,41.91 0 top
IC2  40.26,20.7 0 top
IC4  63.37,16.13 90 top
IC5  90.68,24.64 90 top
IC6  42.04,45.78 90 top
IC7  FDS2672  [SOIC127P600X175-8N']  26.61,35.31 90 top
J2  99.57,3.56 0 top
L2  38.61,52.83 180 top
L3  25.97,46.42 0 top
L5  3.62,39.37 90 top
LED1  88.65,4.06 180 top
LS1  78.49,21.59 270 top
OL2  113.54,32.26 180 top
OLED  24.13,9.65 0 top
P1  46.48,28.7 0 top
P2  45.21,12.19 0 top
P3  100.33,12.95 180 top
PGM  27.62,21.02 180 top
PWM  22.61,16.51 0 bottom
R1  44.07,35.18 270 top
R2  60k4  [R0805']  37.59,43.18 90 top
R3  68.58,6.86 0 top
R4  46.86,35.18 270 top
R5  68.83,10.92 180 top
R6  61.98,10.41 180 top
R7  2k  [R0805']  53.02,41.91 90 top
R8  1k  [R0805']  36.13,35.18 90 top
R9  100k  [R0805']  56.07,41.91 270 top
R10  32.96,35.31 90 top
R11  99.82,18.8 270 top
R12  4.12k  [R0805']  34.42,43.18 90 top
R13  97.03,18.8 270 top
R14  31.75,15.24 0 top
R15  634k  [R0805']  10.73,33.72 180 top
R16  7.68k  [R0805']  20.57,33.72 180 top
R17  90.17,16.51 0 top
R18  102.62,18.8 270 top
R19  105.41,18.8 90 top
R20  19.62,15.3 0 top
R21  15.18,15.3 0 top
R22  80.01,31.94 180 top
R25  25.15,15.24 180 top
R26  19.62,26.1 180 top
R27  15.18,26.1 0 top
R28  67.95,26.29 90 top
S1  78.99,8.38 180 top
T1  50.55,35.18 270 top
T2  19.62,19.75 0 top
T3  15.18,19.75 0 top
T4  63.94,25.72 180 top
TUBES  3.43,21.97 270 top
TUBES1  117.35,24.38 270 top
U$4  3.56,8.38 0 top
U$5  73.66,21.59 0 top
U$20  64.26,43.94 0 top
U$36  118.62,53.85 0 top
Y1  41.4,21.34 0 top

### Tracks (layer width: path | path; a pad name or v marks a point on that pad's centre or on a via)
3-5V
  Top 0.254: OL2.2 117.09,32.26 TUBES1.1
  Bottom 0.254: TUBES1.1 117.35,40.49 115.06,42.77 110.61,42.77 108.6,44.78 88,44.78 77.67,55.12 12.7,55.12 11.81,54.23 11.81,50.8 9.65,48.64 2.54,48.64 1.14,47.24 1.14,30.23 1.78,29.59 TUBES.1 5.36,27.66 6.22,27.66 7.98,25.91 7.98,17.78 8.13,17.63 11.55,17.63 14.33,14.85 14.33,7.75 14.48,7.59 20.04,7.59 20.32,7.87 OLED.1 20.32,11.43 20.83,11.94 33.53,11.94 34.54,10.92 34.54,8.13 35.05,7.62 77.22,7.62 77.98,8.38 77.98,11.68 77.72,11.94 70.87,11.94 70.1,11.18 R5.1
+3V3  (via drill 0.61)
  Top 0.254: R18.2 R11.2 98.3,17.85 | 98.3,17.85 R13.2 | 98.3,17.85 98.3,26.4 C4.1 98.03,29.19 v98.04,29.21 | v113.2,29.04 113.54,29.38 OL2.1
  Top 0.813: C4.1 97.77,26.92 95.76,26.92 91.52,31.16 IC1.VCC
  Top 1.016: IC5.2 90.68,23.37 91.19,23.88 97.28,23.88 98.03,24.62 C4.1
  Bottom 0.254: v113.2,29.04 113.12,28.96 111.51,28.96 111,29.46 111,36.07 110.49,36.58 98.3,36.58 98.04,36.32 v98.04,29.21
+5V  (via drill 0.61)  (1 unrouted)
  Top 0.254: C20.1 46.99,21.02 46.99,18.03 41.91,18.03 | IC4.20 54.34,19.33 C25.1 | 20.57,29.59 | IC4.18 54.42,20.93 | C24.1 52.94,21.84 52.86,29.49 52.96,29.59 | IC4.6 67.16,20.13 | R14.1 R25.1 26.1,15.88 24.14,17.83 24.14,21.85 PGM.2 25.08,21.59 25.09,21.59 25.39,21.29 33.02,21.29 33.53,20.78 33.53,19.05 34.54,18.03 37.08,18.03 | 78.49,24.13 LS1.1 78.49,29.34 78.74,29.59 | J2.1 98.27,7.14 97.79,7.62 97.54,7.62 | 37.08,18.03 41.91,18.03 | IC2.2 37.08,18.03 | C18.1 50.92,50.04 C16.2 | OL2.3 v113.54,48.26 | C22.1 67.13,17.26 | 92.98,17.79 92.96,17.78 | 51.31,29.59 50.17,29.59 49.45,30.3 35.07,30.3 34.36,29.59 | R26.1 20.57,27.43 20.32,27.69 17.53,27.69 v17.53,27.63 | v15.16,27.71 15.14,27.69 14.22,27.43 | Y1.6 41.91,20.68 41.91,18.03 | 42.67,22.02 Y1.4 43.07,21.62 43.2,21.62 43.51,21.31 43.51,20.13 44.09,19.56 46.93,19.56
  Top 0.305: IC4.4 66,18.53 C22.1 | 67.16,20.13 C23.1 | C24.1 53.75,20.26 54.42,20.93 | R17.2 91.12,18.22 91.19,18.29
  Top 0.508: C25.1 C24.1 52.86,29.59 | C22.1 67,18.91 66.86,18.92 | 70.61,29.59 v70.61,26.67 | v70.61,21.84 70.61,18.92 66.86,18.92 | 78.17,29.53 78.23,29.59 | C23.1 67,18.93 66.86,18.92 | C20.1 46.93,19.56 46.93,14.41 46.48,13.97 42.93,13.97 42.67,13.72 P2.2
  Top 0.61: R7.2 57.91,47.75 57.91,52.83 | 61.98,29.59 61.98,32 61.57,32.41 47.6,32.41 46.86,33.15 R4.2 | C20.1 49.02,21.02 49.02,21.08 49.78,21.84 52.94,21.84
  Top 0.813: R22.1 80.96,29.59 78.74,29.59 78.23,29.59 70.61,29.59 61.98,29.59 52.96,29.59 | 52.86,29.59 51.31,29.59 | R27.1 14.22,27.43 14.23,29.59 20.57,29.59 34.36,29.59 | IC5.3 92.98,17.79
  Top 1.016: 97.54,7.62 93.98,7.62 92.96,8.64 92.96,17.78 92.46,18.29 91.19,18.29 85.85,18.29 85.85,29.72 | 85.85,29.72 v85.85,48.26 81.28,52.83 57.91,52.83 53.34,52.83 | 53.34,52.83 L2.1 | C16.2 53.15,52.64 53.34,52.83 | 80.96,29.59 85.73,29.59 85.85,29.72
  Bottom 0.254: v113.54,48.26 v85.85,48.26 | v17.53,27.63 17.48,27.69 15.19,27.69 v15.16,27.71
  Bottom 0.508: v70.61,26.67 v70.61,21.84
BATT  (via drill 0.61)
  Top 0.254: v38.35,29.27 IC2.14 38.35,23.88 38.61,23.62 39.62,23.62 40.05,23.19 Y1.1 | v75.44,32.51 76.96,32.51 78.27,33.82 D40.C 78.49,35.33 78.49,41.66 77.53,42.61 C21.+
  Bottom 0.254: v75.44,32.51 38.86,32.51 38.35,32 v38.35,29.27
BUZ
  Top 0.254: IC4.10 61.37,27.43 61.94,28 64.77,28 | R28.2 67.95,28 64.77,28 | T4.1 64.9,27.88 64.77,28
COM  (via drill 0.61)
  Top 0.254: 46.77,25.3 46.93,25.15
  Top 1.016: IC1.GND 107.92,25.94
  Bottom 0.254: v60.2,37.34 60.96,38.1 | C21.- 61.28,47.69 61.21,47.75
  Bottom 2.54: 60.96,38.1 85.09,38.1 85.85,37.34 85.85,30.48
  other vias: 15.68,10.22 4.7,46.99 17.4,36.89 10.41,36.89 4.38,33.72 10.73,41.47 10.41,38.16 17.4,38.8 23.11,35.31 23.11,33.4 30.23,33.27 30.23,32.26 59.18,46.42 58.93,36 59.18,43.88 59.18,41.21 30.73,37.59 36.96,29.34 59.18,45.15 30.23,34.29 48.58,23.3 49.09,18.73 48.45,45.66 53.15,45.66 50.17,46.04 52.07,33.78 36.32,50.55 66.04,15.75 57.78,34.8 23.62,23.37 107.95,28.7 58.93,34.8 57.78,33.66 58.93,33.66 78.11,13.97 77.09,13.97 57.53,20.45 50.8,23.11 8.13,33.66 107.95,26.16 104.78,25.15 66.42,22.23 72.26,26.03 75.82,26.03 95.38,15.24 61.34,18.29 33.66,24.77 71.88,16.76 88.14,25.65 79.25,8.89 57.53,19.18 61.34,19.56 30.73,36.58 32,39.37 33.53,39.37 35.31,38.1 35.31,39.12 30.73,38.86 95.38,16.26 96.39,16.26 96.39,15.24 107.95,29.72 104.78,26.16 9.91,22.1 11.18,22.1 37.47,32.89 60.2,36 60.2,34.8 60.2,33.66 32.39,24.77 25.15,25.91 23.62,25.91 28.38,14.03 37.02,12.26 17.65,53.53 16.64,53.53 42.99,19.24
  pour Top: -1.65,58.36 61.09,58.36 61.09,32.38 -1.65,32.38
  pour Bottom: 0.25,31.31 0.25,1.52 127.64,1.52 127.64,31.31
  pour Bottom: 61.21,55.05 61.21,32 0.13,32 0.13,55.05
  pour Top: -1.84,26.73 -1.84,-5.46 121.92,-5.46 121.92,26.73
CS  (via drill 0.61)
  Top 0.254: R12.1 35.24,42.23 v36.13,41.34 | R8.2 C11.1 39.12,36.13 v40.17,37.17 | IC6.3 v42.67,40.7
  Bottom 0.254: v40.17,37.17 40.26,37.27 40.26,39.94 | v36.13,41.34 37.53,39.94 40.26,39.94 | 40.26,39.94 41.91,39.94 v42.67,40.7
FB
  Top 0.254: R15.1 C6.2 14.22,33.08 14.22,32.13 14.54,31.81 18.35,31.81 19.62,33.09 R16.2 19.62,36.26 28.19,36.26 28.81,36.87 29.02,36.87 29.72,37.57 29.72,39.12 31.57,40.97 34.64,40.97 35.54,40.07 41.4,40.07 IC6.2 41.4,44.21 41.57,44.39 44.58,44.39 45.72,43.24 45.72,41.15 45.85,41.02 47.1,41.02 C5.2
GPIO0  (via drill 0.61)
  Top 0.254: IC1.GPIO0 102.96,39.71 102.16,38.91 v102.16,34.29 | P3.3 100.33,13.46 103.89,17.02 103.89,19.81 102.68,19.81 R18.1 102.62,23.11 v102.36,23.37
  Bottom 0.254: v102.36,23.37 102.36,29.55 102.16,29.75 v102.16,34.29
HT  (via drill 0.61)
  Top 0.254: TUBES.5 13.27,19.43 13.57,19.73 15.79,19.73 15.81,19.75 16.13,19.43 T3.2 | v101.65,8.97 104.47,8.97 104.52,9.02 106.17,7.37 115.32,7.37 116.08,8.13 116.08,14.73 114.81,16 114.81,17.53 115.32,18.03 118.87,18.03 119.38,18.54 119.38,21.59 119.13,21.84 TUBES1.5
  Bottom 0.254: TUBES.5 5.97,19.43 6.35,19.05 6.35,16.76 7.11,16 10.88,16 12.7,14.18 12.7,6.22 12.95,5.97 63.68,5.97 64.9,4.75 90.26,4.75 94.91,9.4 101.22,9.4 v101.65,8.97
HT-ENABLE  (via drill 0.61)
  Top 0.254: v59.69,30.99 59.25,31.43 44.58,31.43 44.07,31.94 R1.2 | IC4.12 59.69,23.01 v59.69,28.19
  Bottom 0.254: v59.69,30.99 v59.69,28.19
IRQ  (via drill 0.61)
  Top 0.254: TUBES.7 4.57,15.49 9.91,15.49 12.51,12.89 v21.21,12.89 23.3,12.89 24.2,13.78 R25.2 | IC4.11 60.58,20.7 v59.94,20.07 | v100.58,8.13 104.39,8.13 105.66,6.86 116.29,6.86 117.35,7.92 TUBES1.7
  Bottom 0.254: TUBES.7 4.57,15.49 10.67,15.49 12.19,13.97 12.19,5.97 12.7,5.46 63.47,5.46 64.69,4.24 90.6,4.24 95.25,8.89 99.31,8.89 100.08,8.13 v100.58,8.13 | v59.94,20.07 59.94,17.82 61.09,16.68 61.09,16 61.59,15.49 64.71,15.49 65.72,14.48 65.72,8.83 65.28,8.38 35.81,8.38 35.31,8.89 35.31,9.14 35.56,9.4 35.56,12.19 34.86,12.89 v21.21,12.89
LDR  (via drill 0.61)
  Top 0.254: IC4.23 54.53,16.93 53.98,16.38 53.98,9.52 54.36,9.14 65.53,9.14 66.04,9.65 66.7,9.65 66.73,9.68 67.28,9.68 67.56,9.4 | v98.04,45.72 98.03,45.71 IC1.ADC | v113.87,18.8 114.38,19.3 TUBES1.6 | TUBES.6 3.3,16.76 2.54,16.76 1.52,15.75 1.52,6.35 2.2,5.68 69.34,5.68 69.53,5.86 69.53,6.6 | R5.2 67.56,9.4 | 67.56,9.4 68.07,8.89 69.09,8.89 69.6,8.38 69.6,6.86 R3.2 69.53,6.6 | v71.88,6.6 69.53,6.6
  Bottom 0.254: TUBES1.6 118.36,19.3 119.76,20.7 119.76,45.47 118.87,46.35 102.49,46.35 101.85,45.72 v98.04,45.72 | v71.88,6.6 89.94,6.6 92.73,9.4 92.75,9.4 94.28,10.92 102.36,10.92 105.41,7.87 116.08,7.87 116.08,13.99 113.79,16.28 113.79,18.8 v113.87,18.8
LED
  Top 0.254: IC4.25 56.57,11 57.1,10.46 60.97,10.46 R6.2
MISO  (via drill 0.61)
  Top 0.254: v31.56,19.24 PGM.9 | IC4.16 55.5,22.95 v55.5,24.89
  Bottom 0.254: v31.56,19.24 27.88,19.24 27.56,19.56 27.56,25.78 27.88,26.1 42.55,26.1 42.86,26.42 43.94,26.42 | 43.94,26.42 55.12,26.42 55.5,26.03 v55.5,24.89 | P1.1 43.94,26.42
MOSI  (via drill 0.61)
  Top 0.254: PGM.1 25.08,17.97 25.84,17.21 v27.24,17.21 | IC4.15 57.4,22.96 57.4,24.32 57.3,24.42 v57.3,24.93
  Bottom 0.254: v27.24,17.21 26.42,18.03 26.42,26.54 27.05,27.18 40.64,27.18 41.15,27.69 41.15,29.72 42.16,30.73 48.51,30.73 49.02,30.23 P1.3 49.02,28.19 49.53,27.69 56.64,27.69 57.4,26.92 57.4,25.04 v57.3,24.93
N$1
  Top 0.254: R6.1 65.53,10.41 67.06,11.94 68.23,11.94 68.83,11.33 68.83,10.67 69.85,9.65 72.39,9.65 72.9,9.14 72.9,5.33 73.66,4.57 87.59,4.57 LED1.2
N$2  (via drill 0.61)
  Top 0.254: v97.03,35.05 97.03,40.13 93.45,43.71 IC1.CH_PD | v97.03,21.34 R13.1
  Bottom 0.254: v97.03,35.05 v97.03,21.34
N$3
  Top 0.254: LS1.2 78.49,21.38 76.35,23.52 66.66,23.52 65.55,24.62 T4.3
  Top 0.305: LS1.2 81.07,16.51 R17.1
N$5
  Top 0.254: IC4.7 64.77,20.93 64.77,22.03 EXOS.TP
N$6
  Top 0.254: C6.1 16.13,33.72 16.13,34.99 15.81,35.31 9.78,35.31 | R15.2 9.78,35.31 | 9.78,35.31 5.14,35.31 4.79,35.66 4.79,38.35 | 3.87,38.37 L5.1 4.78,38.37 4.79,38.35 | C2.1 7.35,41.27 5.21,41.27 4.79,40.86 4.79,38.35
  Top 0.813: D1.C C1.1 13.91,40.07 13.59,39.75 7.56,39.75 C2.1 C12.1
N$7
  Top 0.254: T2.3 19.45,21.02 17.72,21.02 17.4,20.7 17.4,17.84 17.4,17.14 17.27,17.02 14.18,17.02 | R21.1 14.18,17.02 | 14.18,17.02 14.18,18.6 T3.1
N$8
  Top 0.254: T1.1 46.91,36.13 R4.1 R1.1
N$9  (via drill 0.61)
  Top 0.254: D2.C 53.01,40.98 R7.1 54.99,40.96 R9.2 57.47,40.96 57.53,40.89 v57.59,40.96 | T1.3 51.65,36.41 52.07,36.83 C14.1 v57.53,36.83
  Bottom 0.254: v57.59,40.96 57.59,36.89 v57.53,36.83
N$10
  Top 0.254: IC6.1 40.13,44.96 40.32,45.15 46.67,45.15 47.12,44.7 47.12,43.16 47.24,43.04 | D2.A 49.72,43.04 47.24,43.04 | 47.24,43.04 C5.1
N$11  (via drill 0.61)
  Top 0.254: IC1.GPIO15 104.04,35.71 103.63,35.31 v103.63,34.29 | v105.41,21.34 R19.2
  Bottom 0.254: v103.63,34.29 103.63,23.11 v105.41,21.34
N$12
  Top 0.254: R8.1 34.08,34.23 R10.1
  Top 1.016: 26.61,30.99 32.45,30.99 32.96,31.5 R10.1
  Top 1.27: IC7.1 IC7.2 | IC7.2 IC7.3 | 26.61,30.99 25.97,31.62 IC7.2
N$13
  Top 0.254: Y1.7 40.95,19.11 EXOS1.TP
N$14
  Top 0.254: L2.2 37.61,50.91 38.12,50.4 41.4,50.4 IC6.7 41.4,50.42 42.17,51.18 46.61,51.18 46.99,50.8 C8.2
  Top 0.61: 26.62,52.83 L3.1
  Top 1.016: L2.2 26.62,52.83
N$18
  Top 0.254: C15.1 21.28,38.02 IC7.8 | L3.2 25.7,40.39 25.34,40.39 25.97,39.75 | 24.7,39.75 25.07,39.75 L3.2 | L3.2 26.87,40.65 27.24,41.02 28.51,39.75
  Top 0.508: IC7.5 28.51,39.75
  Top 0.813: 25.97,39.75 IC7.7 | L3.2 27.24,39.38 IC7.6 | 24.7,39.75 IC7.8
  Top 2.54: D1.A 18.06,50.21 19.62,48.64 19.62,41.34 20.57,40.39 25.34,40.39
N$19
  Top 0.254: R20.1 18.67,15.4 T2.1
N$23
  Top 0.254: D40.A 81.47,35.12 79.06,32.7 R22.2
OUT  (via drill 0.61)
  Top 0.254: 28.51,34.35 v28.51,34.67
  Top 0.305: IC7.4 28.51,34.35 | IC6.6 42.67,46.42 v42.55,46.29
  Bottom 0.254: v28.51,34.67 29.15,35.31 45.08,35.31 45.59,35.81 45.59,45.97 45.28,46.29 v42.55,46.29
PWM  (via drill 0.61)
  Top 0.254: IC4.14 58.36,23.1 58.36,25.46 v58.61,25.72 | R20.2 19.94,15.84 v19.94,16.89
  Bottom 0.254: PWM.TP 22.23,16.89 v19.94,16.89 19.94,26.8 20.83,27.69 39.62,27.69 40.39,28.45 40.39,29.72 41.91,31.24 49.78,31.24 49.96,31.06 49.96,28.7 50.47,28.19 57.61,28.19 58.61,27.2 v58.61,25.72
RAW_HT  (via drill 0.61)
  Top 0.254: T3.3 15.03,20.7 1.27,20.7 1.14,20.83 | 3.56,41.91 v3.68,42.04 | R21.2 16.03,14.57 15.49,14.03 12.95,14.03 12.32,14.67 12.32,18.03 12,18.35 1.71,18.35 1.14,18.92 1.14,20.83 | L5.2 3.53,40.28 2.92,40.28 | C3.1 1.14,32.43 1.14,20.83
  Top 0.508: 2.92,40.28 2.43,39.79 C3.1 | L5.2 3.62,41.85 3.56,41.91
  Bottom 0.254: HT.TP 3.68,43.43 v3.68,42.04
RC  (via drill 0.61)
  Top 0.254: R2.1 38.8,41.02 v39.37,41.02 | v44.58,41.27 43.94,41.91 IC6.4 | C7.1 42.8,37.4 v42.8,37.46
  Bottom 0.254: v39.37,41.02 41.78,41.02 42.3,41.54 44.31,41.54 v44.58,41.27 44.43,41.27 42.8,39.64 v42.8,37.46
REF
  Top 0.254: C10.1 34.42,48.58 R12.2 R2.2 37.59,48.13 37.91,48.45 40.13,48.45 IC6.8
RESET  (via drill 0.61)
  Top 0.254: v57.53,12.19 59.31,12.19 59.77,12.65 IC4.29 | PGM.5 27.62,20.23 28.07,20.68 32.51,20.68 32.77,20.42 32.77,15.31 R14.2 32.77,15.17 32.67,15.08 32.67,9.24 33.53,8.38 50.29,8.38 | P2.5 50.29,8.38 | v66.8,8.64 66.55,8.38 50.29,8.38 | S1.1 76.74,10.63 v76.71,10.67 81.79,10.67 84.84,7.62 89.66,7.62 v90.93,8.89 | IC1.RESET 99.1,47.71 99.57,47.24 v99.57,38.35 | v99.82,21.08 R11.1 | v104.65,10.16 106.93,7.87 115.06,7.87 115.57,8.38 115.57,13.72 113.03,16.26 v113.03,23.37
  Bottom 0.254: v57.53,12.19 P2.5 | v66.8,8.64 67.06,8.89 76.71,8.89 v76.71,10.67 | v90.93,8.89 91.51,8.89 94.05,11.43 97.79,11.43 | v99.57,38.35 99.64,38.28 114.63,38.28 115.06,37.85 115.06,29.72 113.03,27.69 v113.03,23.37 | 97.79,11.43 P3.4 97.79,14.22 99.82,16.26 v99.82,21.08 | v104.65,10.16 103.38,11.43 97.79,11.43
RX  (via drill 0.61)
  Top 0.254: v28.51,25.21 26.86,25.21 26.35,24.7 PGM.4 | IC4.30 60.58,13.03 61.47,12.14 63.93,12.14 v64.64,11.43
  Bottom 0.254: v64.64,11.43 64.77,11.3 64.77,9.14 64.52,8.89 45.97,8.89 45.21,9.65 P2.3 45.21,13.72 44.7,14.22 33.02,14.22 32.51,14.73 32.51,20.51 32.23,20.8 29.5,20.8 28.51,21.78 v28.51,25.21
RX3.3  (via drill 0.61)
  Top 0.254: v110.49,39.12 v110.49,27.69 | IC1.RXD0 104.89,45.71 104.65,45.47 v104.65,41.91
  Bottom 0.254: v104.65,41.91 104.14,41.4 104.14,40.06 105.08,39.12 v110.49,39.12 | v110.49,27.69 110.49,17.14 107.82,14.48 103.38,14.48 102.87,13.97 P3.2
SCK  (via drill 0.61)
  Top 0.254: v29.27,16.95 28.89,17.34 PGM.7 | IC4.17 54.42,22.67 v54.42,23.81
  Bottom 0.254: v54.42,23.81 56.19,23.81 56.45,24.07 56.45,26.61 55.88,27.18 46.74,27.18 46.48,27.43 P1.2 46.48,29.46 45.72,30.23 42.42,30.23 41.91,29.72 41.91,26.92 41.66,26.67 27.5,26.67 26.92,26.1 26.92,18.92 28.89,16.95 v29.27,16.95
SCL  (via drill 0.61)
  Top 0.254: TUBES.3 3.43,24.26 4.19,23.49 17.65,23.49 17.66,23.5 18.67,23.5 | 18.67,23.5 R26.2 | v59.69,16.89 59.61,16.97 58.98,16.97 IC4.28 | 18.67,23.5 21.4,23.5 22.23,24.32 22.23,27.49 22.67,27.94 35.24,27.94 35.81,27.37 IC2.16 v35.81,21.02 35.81,19.81 36.07,19.56 39.88,19.56 39.88,19.55 40.05,19.72 Y1.8 | IC1.GPIO5 v111,43.71
  Bottom 0.254: v59.69,16.89 59.69,15.94 59.5,15.75 36.32,15.75 35.81,16.26 v35.81,21.02 | 25.4,6.48 13.46,6.48 13.21,6.73 13.21,14.39 11.09,16.51 7.62,16.51 6.86,17.27 6.86,23.88 6.22,24.51 TUBES.3 | 25.4,6.48 63.89,6.48 65.11,5.26 90.05,5.26 94.7,9.91 101.9,9.91 104.95,6.86 117.09,6.86 117.09,14.41 115.32,16.19 115.32,25.91 116.33,26.92 TUBES1.3 118.62,26.92 119.25,27.56 119.25,43.31 118.87,43.69 111.02,43.69 v111,43.71 | OLED.3 25.4,6.48
SDA  (via drill 0.61)
  Top 0.254: R27.2 16.13,24.83 16.06,24.77 10.79,24.77 10.73,24.83 10.73,26.73 10.41,27.05 | IC4.27 58.19,16.42 57.91,16.7 v57.66,16.7 | v37.08,21.02 IC2.15 37.08,28.07 36.58,28.58 16.7,28.58 16.13,28 | Y1.2 40.95,22.95 41.37,23.37 44.2,23.37 44.45,23.11 v44.45,20.52 | IC1.GPIO4 107.98,41.66 v111,41.66
  Top 0.305: R27.2 16.13,28 | 10.41,27.05 TUBES.2
  Bottom 0.254: v37.08,21.02 37.08,17.53 37.91,16.7 44.45,16.7 | 44.45,16.7 v57.66,16.7 | 115.82,29.46 115.57,29.46 114.81,28.7 114.81,15.98 116.59,14.2 116.59,7.37 105.16,7.37 102.11,10.41 94.49,10.41 89.84,5.77 65.32,5.77 64.1,6.98 27.05,6.98 26.67,7.37 26.67,10.92 26.42,11.18 23.11,11.18 22.86,10.92 OLED.2 22.86,7.24 22.61,6.98 13.97,6.98 13.72,7.24 13.72,14.6 11.3,17.02 7.87,17.02 7.37,17.53 7.37,25.65 5.97,27.05 TUBES.2 | 115.82,29.46 TUBES1.2 | v111,41.66 115.32,41.66 115.75,41.22 115.75,29.54 115.82,29.46 | v44.45,20.52 44.45,16.7
TX  (via drill 0.61)
  Top 0.254: PGM.6 27.62,24.26 28.89,24.26 v29.78,25.15 | IC4.31 61.37,13.59 v63.37,13.59
  Bottom 0.254: v63.37,13.59 63.37,9.78 62.99,9.4 48.51,9.4 47.75,10.16 P2.4 47.75,14.48 47.24,14.99 34.04,14.99 33.27,15.75 33.27,21.42 33.06,21.63 33.02,21.59 30.23,21.59 29.78,22.03 v29.78,25.15
TX3.3  (via drill 0.61)
  Top 0.254: IC1.TXD0 106.13,47.71 103.38,44.96 v103.38,43.43 | v111.51,40.13 111.76,39.88 v111.76,27.69
  Bottom 0.254: P3.1 107.44,12.95 111.76,17.27 v111.76,27.69 | v111.51,40.13 106.1,40.13 105.75,40.47 105.75,42.84 105.16,43.43 v103.38,43.43

### Text on the board
tNames: www.steamclock.ch | Mark 1.9.0 | 5 | +BATT+